# Altium project NB_Badge.PrjPcb
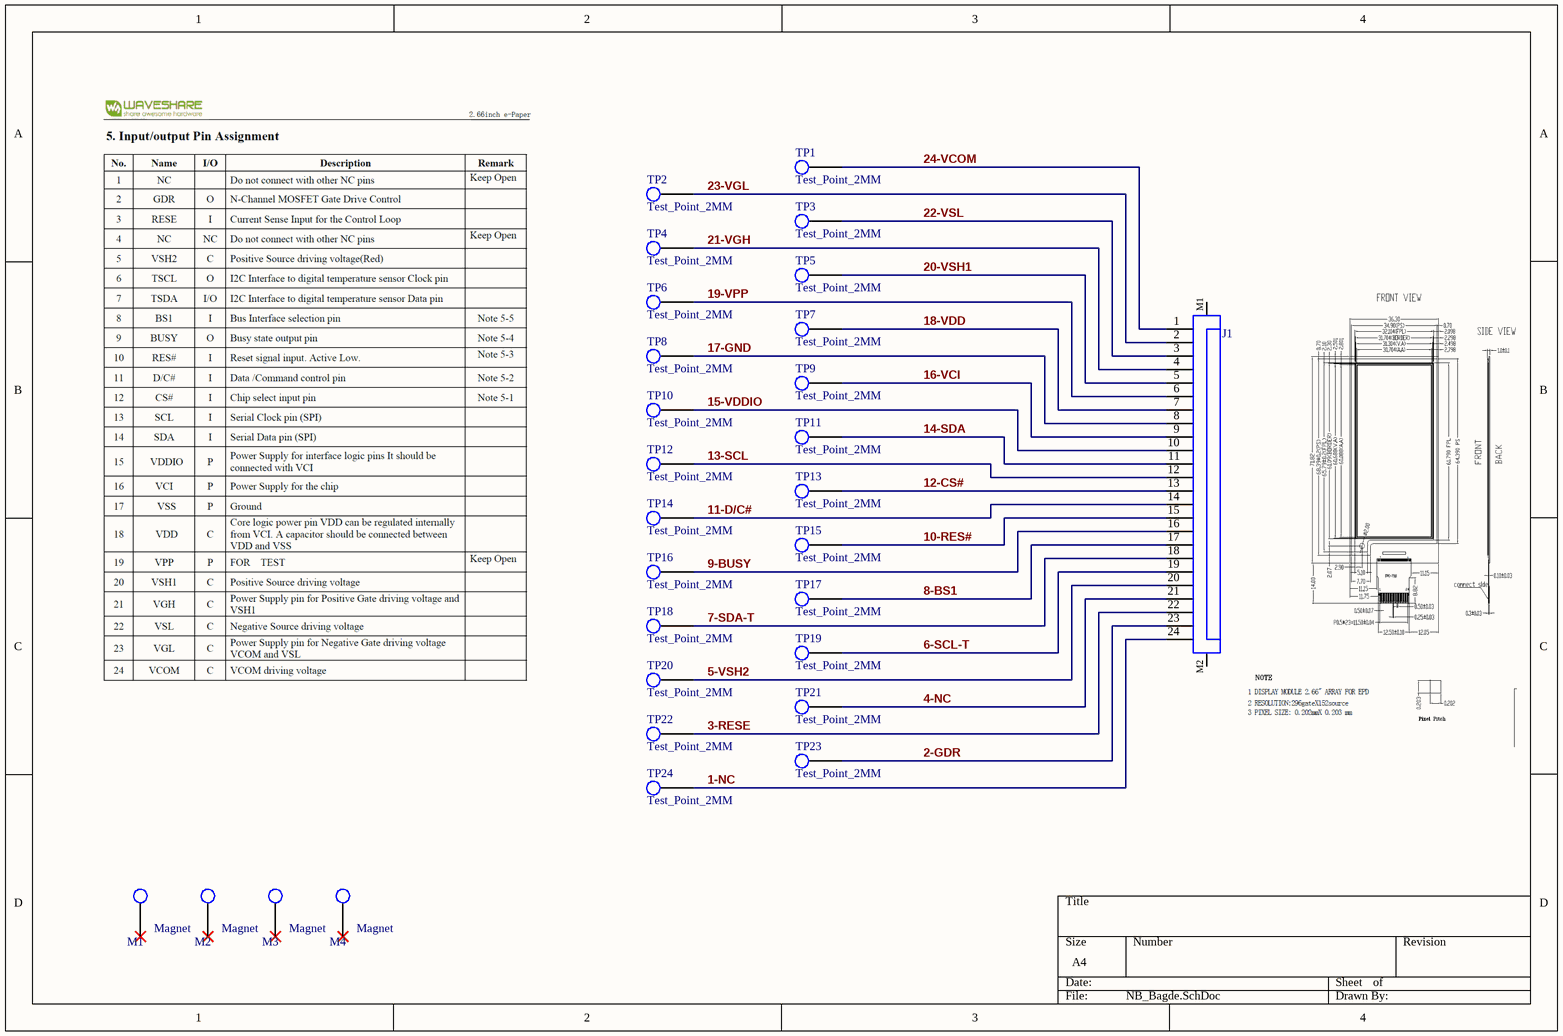
[diagram p0: NB_Bagde.SchDoc]
ProjectTitle: NB_Badge; Variant: 2
1 sheet, 29 parts. Net scope: global (net labels, ports and power ports of the same name join across sheets).
Board file: NB_Bagde.PcbDoc

## Sheet NB_Bagde.SchDoc
size A4; SheetNumber: 1; SheetTotal: 1

### Parts
J1  687124182122  [687124182122]  (value not drawn)
M1  Magnet  [Magnet]
M2  Magnet  [Magnet]
M3  Magnet  [Magnet]
M4  Magnet  [Magnet]
TP1  Test_Point_2MM  [Test_Point_2mm]  (no BOM)
TP2  Test_Point_2MM  [Test_Point_2mm]  (no BOM)
TP3  Test_Point_2MM  [Test_Point_2mm]  (no BOM)
TP4  Test_Point_2MM  [Test_Point_2mm]  (no BOM)
TP5  Test_Point_2MM  [Test_Point_2mm]  (no BOM)
TP6  Test_Point_2MM  [Test_Point_2mm]  (no BOM)
TP7  Test_Point_2MM  [Test_Point_2mm]  (no BOM)
TP8  Test_Point_2MM  [Test_Point_2mm]  (no BOM)
TP9  Test_Point_2MM  [Test_Point_2mm]  (no BOM)
TP10  Test_Point_2MM  [Test_Point_2mm]  (no BOM)
TP11  Test_Point_2MM  [Test_Point_2mm]  (no BOM)
TP12  Test_Point_2MM  [Test_Point_2mm]  (no BOM)
TP13  Test_Point_2MM  [Test_Point_2mm]  (no BOM)
TP14  Test_Point_2MM  [Test_Point_2mm]  (no BOM)
TP15  Test_Point_2MM  [Test_Point_2mm]  (no BOM)
TP16  Test_Point_2MM  [Test_Point_2mm]  (no BOM)
TP17  Test_Point_2MM  [Test_Point_2mm]  (no BOM)
TP18  Test_Point_2MM  [Test_Point_2mm]  (no BOM)
TP19  Test_Point_2MM  [Test_Point_2mm]  (no BOM)
TP20  Test_Point_2MM  [Test_Point_2mm]  (no BOM)
TP21  Test_Point_2MM  [Test_Point_2mm]  (no BOM)
TP22  Test_Point_2MM  [Test_Point_2mm]  (no BOM)
TP23  Test_Point_2MM  [Test_Point_2mm]  (no BOM)
TP24  Test_Point_2MM  [Test_Point_2mm]  (no BOM)

### Nets
1-NC: J1.24 TP24.1
2-GDR: J1.23 TP23.1
3-RESE: J1.22 TP22.1
4-NC: J1.21 TP21.1
5-VSH2: J1.20 TP20.1
6-SCL-T: J1.19 TP19.1
7-SDA-T: J1.18 TP18.1
8-BS1: J1.17 TP17.1
9-BUSY: J1.16 TP16.1
10-RES#: J1.15 TP15.1
11-D/C#: J1.14 TP14.1
12-CS#: J1.13 TP13.1
13-SCL: J1.12 TP12.1
14-SDA: J1.11 TP11.1
15-VDDIO: J1.10 TP10.1
16-VCI: J1.9 TP9.1
17-GND: J1.8 TP8.1
18-VDD: J1.7 TP7.1
19-VPP: J1.6 TP6.1
20-VSH1: J1.5 TP5.1
21-VGH: J1.4 TP4.1
22-VSL: J1.3 TP3.1
23-VGL: J1.2 TP2.1
24-VCOM: J1.1 TP1.1

Not connected (* = marked no-connect by the designer): J1 M1 M2; M1 1*; M2 1*; M3 1*; M4 1*

### Library data of the parts
J1 = 687124182122: WR-FPC SMT ZIF Horizontal Dual Contact, pitch 0.5mm, Horizontal, 24pins; Manufacturer: Wurth Elektronik; Contact Resistance: 30mΩ; Rated Current: 0.5A; Working Voltage: 50VAC; ComponentLink1Description: Website Link; ComponentLink1URL: https://www.we-online.com/redexpert/article/687124182122?ad; ComponentLink2Description: Datasheet Link; ComponentLink2URL: https://www.we-online.com/redexpert/spec/687124182122?ad; Manufacturer Part Number: 687124182122; Category: FPC Connectors; Match Code: WR-FPC; Mount: Surface Mount; Operating Temperature Max: 85°C; Operating Temperature Min: -55°C; Packaging: Tape and Reel; Length: 14mm; Width: 3.7mm; Height: 0.96mm; Number of Pins: 24; Orientation: Horizontal; Pitch: 0.5mm
M1-M4 = Magnet: Magnet 3x2mm
TP1-TP24 = Test_Point_2MM: Test Point

## Assembly variants
v2: all parts fitted
v1: all parts fitted